# EAGLE design CityFireFly_3.0v (EAGLE 7.5.0)
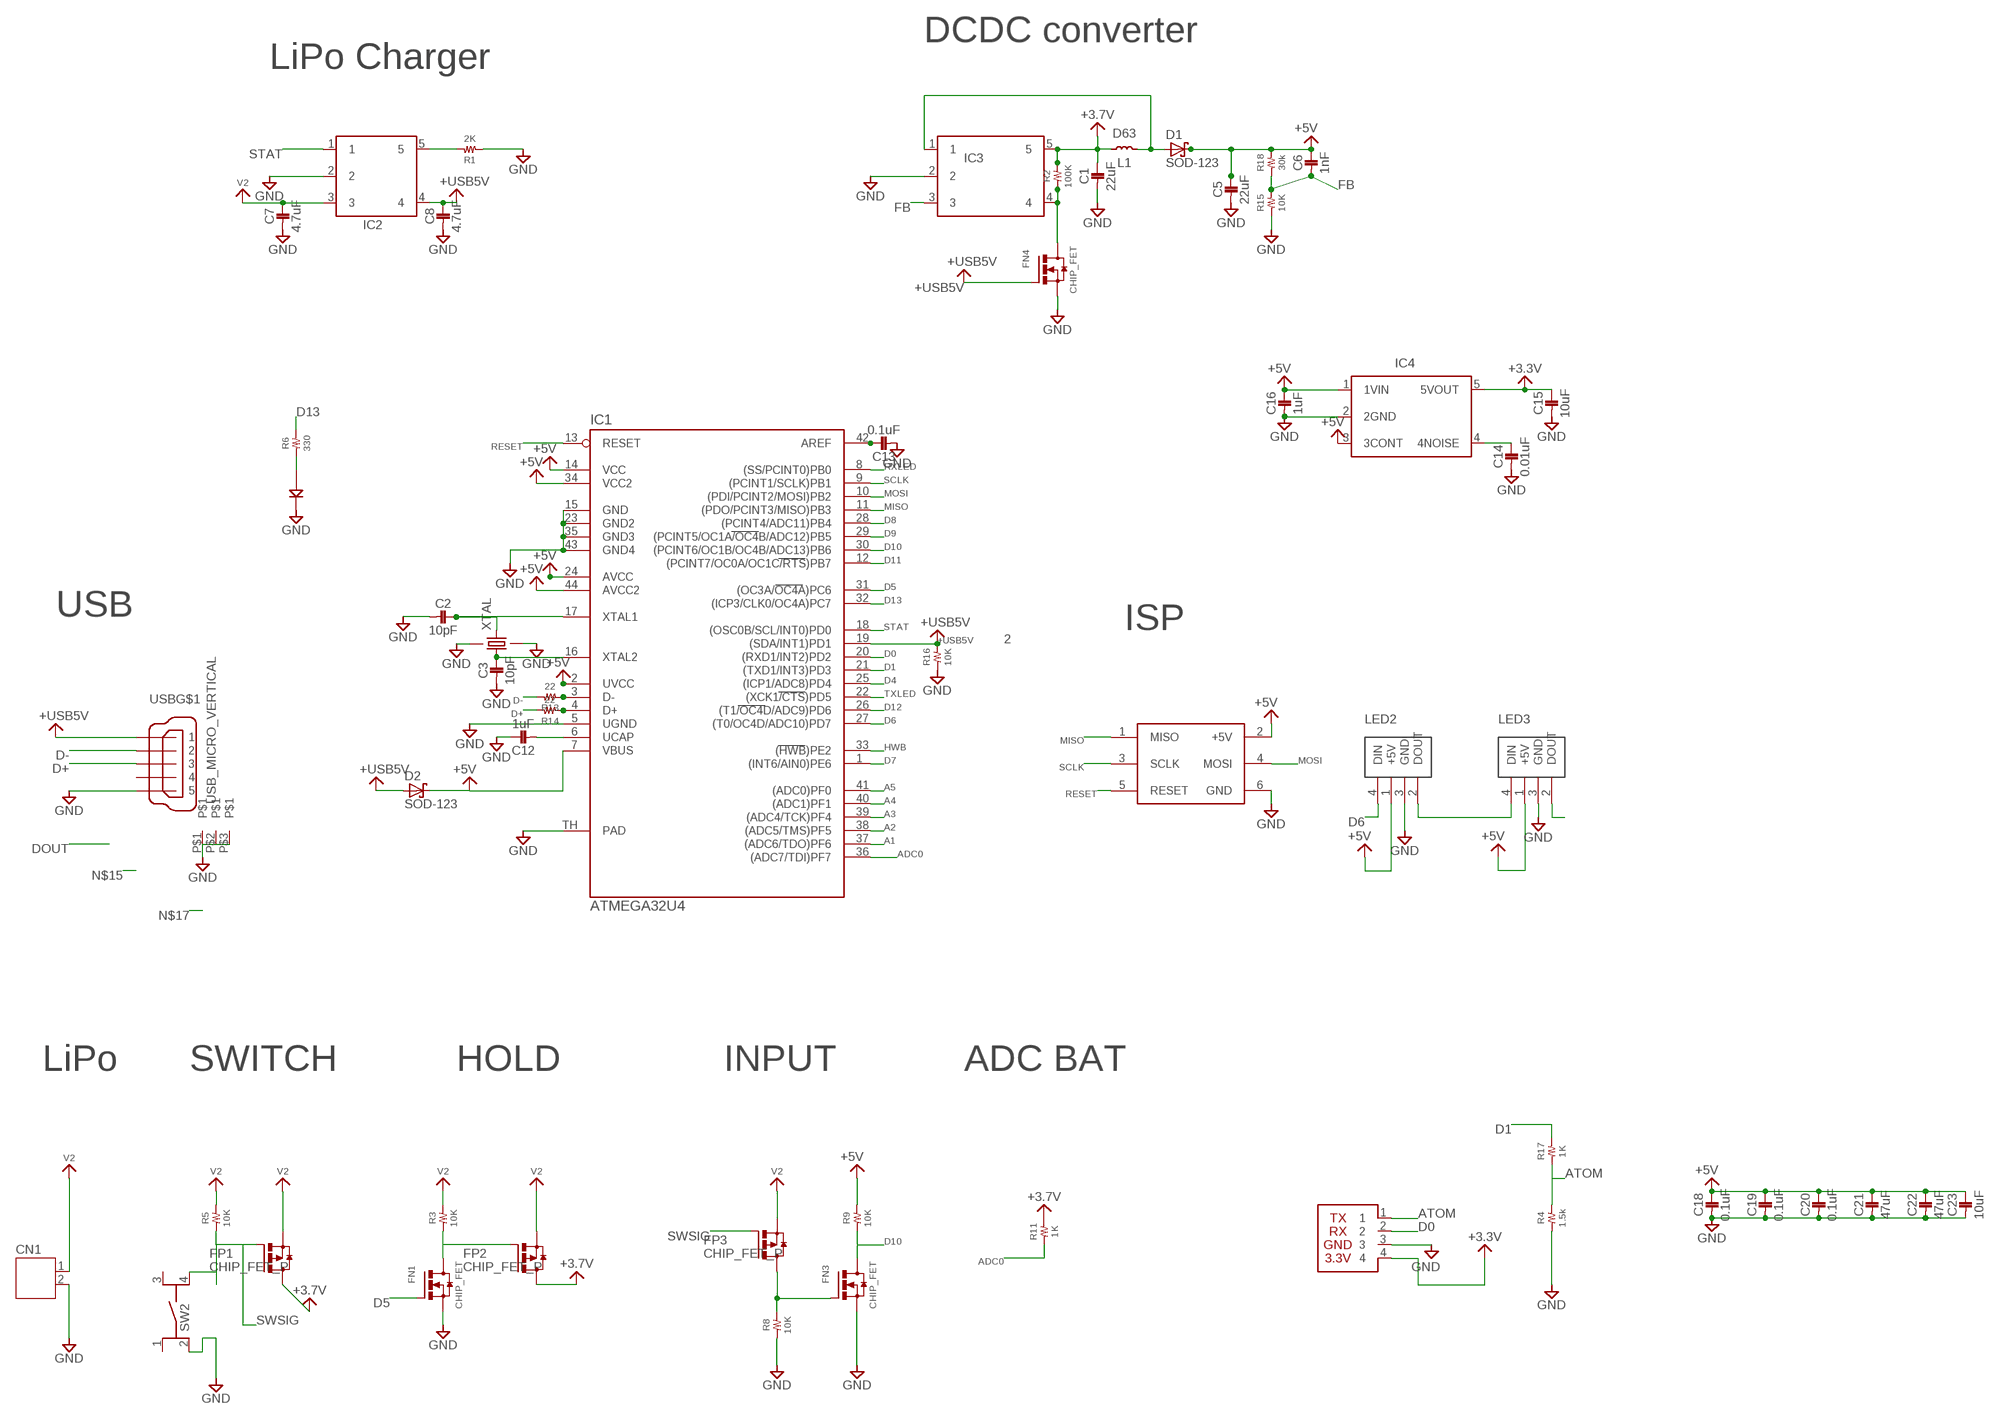
[diagram p0: schematic, sheet 1]

## Parts
BLE  BLE_SERIAL2_NO_HOLE  [BLESERIAL2_NO_HOLE]
C1  22uF  1608  [1608]
C2  10pF  1005  [1005]
C3  10pF  1005  [1005]
C5  22uF  1608  [1608]
C6  1nF  1005  [1005]
C7  4.7uF  1005  [1005]
C8  4.7uF  1005  [1005]
C12  1uF  1005  [1005]
C13  0.1uF  1005  [1005]
C14  0.01uF  1608  [1608]
C15  10uF  1608  [1608]
C16  1uF  1005  [1005]
C18  0.1uF  1005  [1005]
C19  0.1uF  1005  [1005]
C20  0.1uF  1005  [1005]
C21  47uF  1608  [1608]
C22  47uF  1608  [1608]
C23  10uF  1608  [1608]
CN1  JST-PH2  [JST-PH2]
D1  SOD-123  [SOD_123]
D2  SOD-123  [SOD_123]
FN1  CHIP_FET  [SOT23]
FN3  CHIP_FET  [SOT23]
FN4  CHIP_FET  [SOT23]
FP1  CHIP_FET_P  [SOT23]
FP2  CHIP_FET_P  [SOT23]
FP3  CHIP_FET_P  [SOT23]
IC1  ATMEGA32U4  [QFN-44-7X7]
IC2  MCP73831  [SOT23-5L]
IC3  LM2735  [SOT23-5L]
IC4  TAR5SB  [SSOP5-P-0.95]
L1  D63  [TOKO]
LED1  3MMLED  [3MM]
LED2  NEO_FLAT  [NEO_FLAT]
LED3  NEO_FLAT  [NEO_FLAT]
R1  2K  RESISTOR_1005  [1005]
R2  100K  RESISTOR_1005  [1005]
R3  10K  RESISTOR_1005  [1005]
R4  1.5k  RESISTOR_1005  [1005]
R5  10K  RESISTOR_1005  [1005]
R6  330  RESISTOR_1005  [1005]
R8  10K  RESISTOR_1005  [1005]
R9  10K  RESISTOR_1005  [1005]
R11  1K  RESISTOR_1005  [1005]
R13  22  RESISTOR_1005  [1005]
R14  22  RESISTOR_1005  [1005]
R15  10K  RESISTOR_1005  [1005]
R16  10K  RESISTOR_1005  [1005]
R17  1K  RESISTOR_1005  [1005]
R18  30k  RESISTOR_1005  [1005]
SW2  SKRPACE010  [SKRP]
U$3  ICSP  [ICSP]
USB  USB_MICRO_VERTICAL  [USB_MICRO_VERTICAL]
XTAL  FA-238  [FA-238]

## Nets
+3.3V: BLE.4 C15.P$1 IC4.5(5VOUT)
+3.7V: C1.P$1 FP1.3(D) FP2.3(D) IC3.5 L1.1 R2.2 R11.2
+5V: C5.P$1 C6.1 C16.1 C18.1 C19.1 C20.1 C21.P$1 C22.P$1 C23.P$1 D1.C D2.C IC1.2(UVCC) IC1.7(VBUS) IC1.14(VCC) IC1.24(AVCC) IC1.34(VCC2) IC1.44(AVCC2) IC4.1(1VIN) IC4.3(3CONT) LED2.1(+5V) LED3.1(+5V) R9.2 R18.2 U$3.2(+5V)
+USB5V: C8.1 D2.A FN4.1(G) IC1.19((SDA/INT1)PD1) IC2.4 R16.2 USB.1
A1: IC1.37((ADC6/TDO)PF6)
A2: IC1.38((ADC5/TMS)PF5)
A3: IC1.39((ADC4/TCK)PF4)
A4: IC1.40((ADC1)PF1)
A5: IC1.41((ADC0)PF0)
ADC0: IC1.36((ADC7/TDI)PF7) R11.1
ATOM: BLE.1 R4.2 R17.1
D0: BLE.2 IC1.20((RXD1/INT2)PD2)
D1: IC1.21((TXD1/INT3)PD3) R17.2
D4: IC1.25((ICP1/ADC8)PD4)
D5: FN1.1(G) IC1.31((OC3A/OC4A)PC6)
D6: IC1.27((T0/OC4D/ADC10)PD7) LED2.4(DIN)
D7: IC1.1((INT6/AIN0)PE6)
D8: IC1.28((PCINT4/ADC11)PB4)
D9: IC1.29((PCINT5/OC1A/OC4B/ADC12)PB5)
D10: FN3.3(D) IC1.30((PCINT6/OC1B/OC4B/ADC13)PB6) R9.1
D11: IC1.12((PCINT7/OC0A/OC1C/RTS)PB7)
D12: IC1.26((T1/OC4D/ADC9)PD6)
D13: IC1.32((ICP3/CLK0/OC4A)PC7) R6.2
D+: R14.2 USB.3
D-: R13.2 USB.2
DOUT: LED2.2(DOUT) LED3.4(DIN)
FB: C6.2 IC3.3 R15.2 R18.1
GND: BLE.3 C1.P$2 C2.2 C3.2 C5.P$2 C7.2 C8.2 C12.1 C13.2 C14.P$2 C15.P$2 C16.2 C18.2 C19.2 C20.2 C21.P$2 C22.P$2 C23.P$2 CN1.2 FN1.2(S) FN3.2(S) FN4.2(S) IC1.5(UGND) IC1.15(GND) IC1.23(GND2) IC1.35(GND3) IC1.43(GND4) IC1.TH(PAD) IC2.2 IC3.2 IC4.2(2GND) LED1.K LED2.3(GND) LED3.3(GND) R1.1 R4.1 R8.1 R15.1 R16.1 SW2.2(1_) U$3.6(GND) USB.5 USB.P$1 USB.P$2 USB.P$3 XTAL.2 XTAL.4
HWB: IC1.33((HWB)PE2)
MISO: IC1.11((PDO/PCINT3/MISO)PB3) U$3.1(MISO)
MOSI: IC1.10((PDI/PCINT2/MOSI)PB2) U$3.4(MOSI)
N$1: LED1.A R6.1
N$2: IC2.5 R1.2
N$3: FN4.3(D) IC3.4 R2.1
N$4: D1.A IC3.1 L1.2
N$6: FN1.3(D) FP2.1(G) R3.1
N$7: C3.1 IC1.16(XTAL2) XTAL.1
N$8: IC1.3(D-) R13.1
N$9: C13.1 IC1.42(AREF)
N$10: C2.1 IC1.17(XTAL1) XTAL.3
N$14: IC1.4(D+) R14.1
N$16: C14.P$1 IC4.4(4NOISE)
N$18: C12.2 IC1.6(UCAP)
OPTION: LED3.2(DOUT)
RESET: IC1.13(RESET) U$3.5(RESET)
RXLED: IC1.8((SS/PCINT0)PB0)
SCLK: IC1.9((PCINT1/SCLK)PB1) U$3.3(SCLK)
SIG: FN3.1(G) FP3.3(D) R8.2
STAT: IC1.18((OSC0B/SCL/INT0)PD0) IC2.1
SWSIG: FP1.1(G) FP3.1(G) R5.1 SW2.4(2_)
TXLED: IC1.22((XCK1/CTS)PD5)
V2 [POWER]: C7.1 CN1.1 FP1.2(S) FP2.2(S) FP3.2(S) IC2.3 R3.2 R5.2
Unconnected: SW2.1 SW2.3 USB.4

## Notes on the sheet
- DCDC converter
- LiPo Charger
- USB
- ISP
- 2
- LiPo | SWITCH | HOLD | INPUT | ADC BAT

## Library data of the parts
BLE = 12_module:BLE_SERIAL2_NO_HOLE
C1 C5 C14 C15 C21-C23 = 02_C:1608
C2 C3 C6-C8 C12 C13 C16 C18-C20 = 02_C:1005
CN1 = jst-ph (1):JST-PH2
D1 D2 = 15_DIODE:SOD-123
FN1 FN3 FN4 = 06_FET:CHIP_FET
FP1-FP3 = 06_FET:CHIP_FET_P
IC1 = 04_IC:ATMEGA32U4
IC2 = 04_IC:MCP73831
IC3 = 04_IC:LM2735
IC4 = 04_IC:TAR5SB
L1 = 03_L:D63
LED1 = 10_LED:3MMLED
LED2 LED3 = 10_LED:NEO_FLAT
R1-R6 R8 R9 R11 R13-R18 = 01_R:RESISTOR_1005
SW2 = 09_1_switch:SKRPACE010
U$3 = 08_CONECTOR:ICSP
USB = 08_CONECTOR:USB_MICRO_VERTICAL
XTAL = 09_2_CRYSTAL:FA-238

## Board
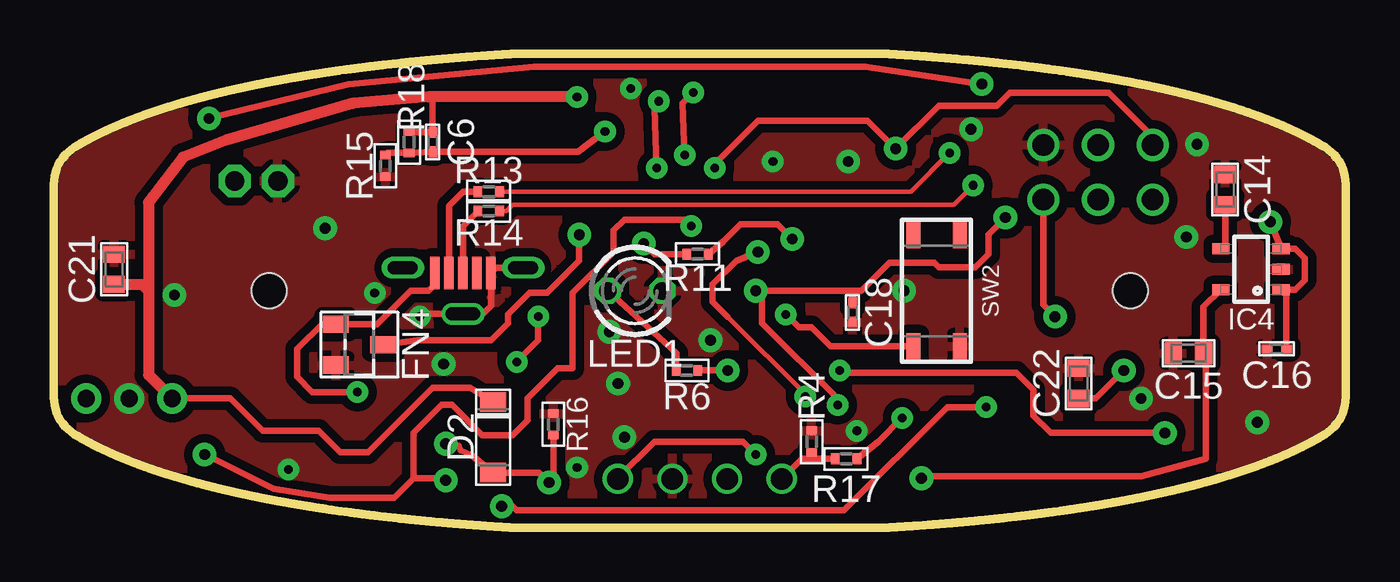
[diagram p1: board, top side]
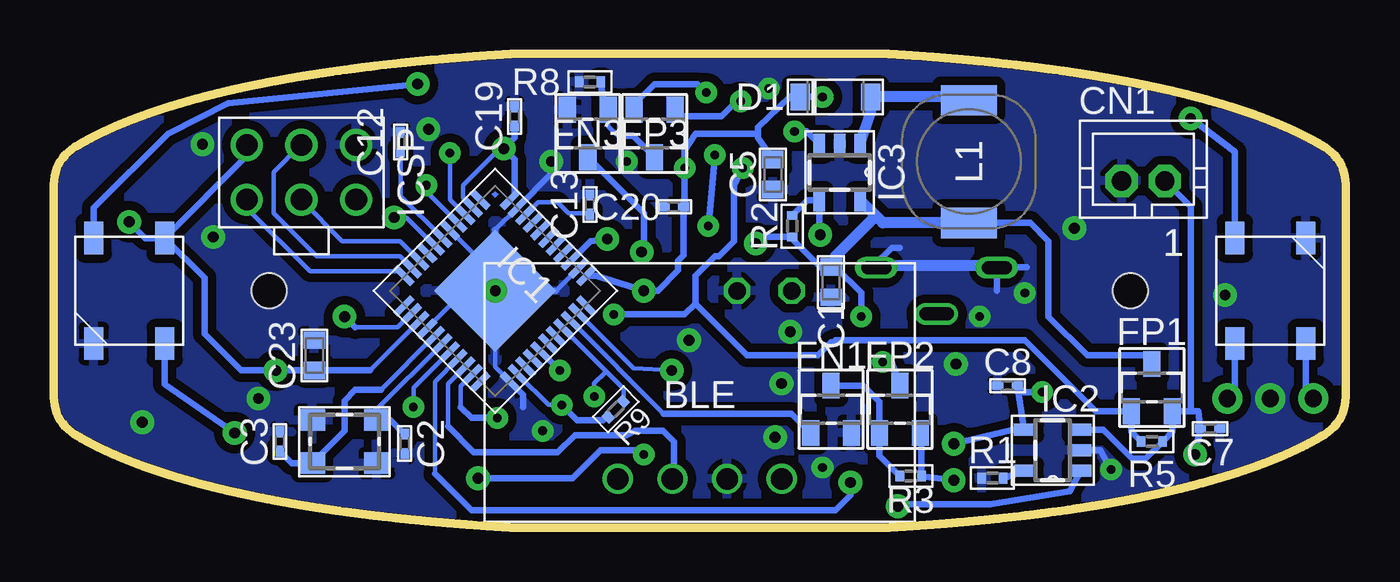
[diagram p2: board, bottom side, seen from below]

Size 60 x 22 mm. Coordinates in mm from the lower left corner, seen from the top.
Outline: 1964 segments
Copper layers (1*16): Top 0.035mm / dielectric 1.5mm / Bottom 0.035mm
Design rules "default *": minimum track width 0.2mm, minimum drill 0.4mm, track to track 0.4mm, track to pad 0.4mm, pad to pad 0.4mm, via to via 0.4mm, smd to smd 0.4mm, copper to edge 1mil, drill to drill 8mil, minimum pad ring 0.2mm, minimum via ring 0.3mm, stop-mask expansion 4mil, vias tented up to drill 0mil, thermal gap 10mil
Holes 1.6 mm at 10,11 50,11

### Footprints (pad centres in the part's own frame; a part is rotated, then mirrored left to right if it is on the bottom)
BLESERIAL2_NO_HOLE = drill 1: 1 -3.81,-2.73; 2 -1.27,-2.73; 3 1.27,-2.73; 4 3.81,-2.73
1608 = smd 0.8 x 1: P$1 -0.7,0; P$2 0.7,0
1005 = smd 0.5 x 0.4: 1 -0.45,0; 2 0.45,0
JST-PH2 = drill 0.9 pad 1.5 octagon: 1 1,0; 2 -1,0
SOD_123 = smd 0.915 x 1.22: A -1.64,0; C 1.64,0
SOT23 = smd 0.8 x 1.2: 1 -0.95,-1.1; 2 0.95,-1.1; 3 0,1.1
QFN-44-7X7 = smd 1.1 x 0.3: 1 -3.5,2.5; 2 -3.5,2; 3 -3.5,1.5; 4 -3.5,1; 5 -3.5,0.5; 6 -3.5,0; 7 -3.5,-0.5; 8 -3.5,-1; 9 -3.5,-1.5; 10 -3.5,-2; 11 -3.5,-2.5; 23 3.5,-2.5; 24 3.5,-2; 25 3.5,-1.5; 26 3.5,-1; 27 3.5,-0.5; 28 3.5,0; 29 3.5,0.5; 30 3.5,1; 31 3.5,1.5; 32 3.5,2; 33 3.5,2.5 | smd 0.3 x 1.1: 12 -2.5,-3.5; 13 -2,-3.5; 14 -1.5,-3.5; 15 -1,-3.5; 16 -0.5,-3.5; 17 0,-3.5; 18 0.5,-3.5; 19 1,-3.5; 20 1.5,-3.5; 21 2,-3.5; 22 2.5,-3.5; 34 2.5,3.5; 35 2,3.5; 36 1.5,3.5; 37 1,3.5; 38 0.5,3.5; 39 0,3.5; 40 -0.5,3.5; 41 -1,3.5; 42 -1.5,3.5; 43 -2,3.5; 44 -2.5,3.5 | smd 4 x 4: TH 0,0
SOT23-5L = smd 0.55 x 1: 1 -0.95,-1.3; 2 0,-1.3; 3 0.95,-1.3; 4 0.95,1.3; 5 -0.95,1.3
SSOP5-P-0.95 = smd 0.5 x 0.8: 1 -0.95,-1.4; 2 0,-1.4; 3 0.95,-1.4; 4 0.95,1.4; 5 -0.95,1.4
TOKO = smd 1.4 x 2.6: 1 -2.85,0; 2 2.85,0
3MM = drill 0.813 octagon: A 0,1.27; K 0,-1.27
NEO_FLAT = smd 1.5 x 0.9: 1 -2.45,1.65; 2 -2.45,-1.65; 3 2.45,-1.65; 4 2.45,1.65
1005' = smd 0.4 x 0.5: 1 -0.5,0; 2 0.5,0
SKRP = smd 1.2 x 0.65: 1 -2.575,1.075; 2 2.575,1.075; 3 -2.575,-1.075; 4 2.575,-1.075
ICSP = drill 1 pad 1.5: 1 -1.27,2.54; 2 1.27,2.54; 3 -1.27,0; 4 1.27,0; 5 -1.27,-2.54; 6 1.27,-2.54
USB_MICRO_VERTICAL = smd 0.45 x 1.5: 1 -1.3,0.825; 2 -0.65,0.825; 3 0,0.825; 4 0.65,0.825; 5 1.3,0.825 | drill 0.6 long: P$1 0,-1.075; P$2 -2.8,1.075; P$3 2.8,1.075 | drill 0.5: P$4 -2.8,1.075; P$11 2.8,1.075 | drill 0.6: P$5 -2.9,1.075; P$6 -3,1.075; P$7 -3.2,1.075; P$8 -2.7,1.075; P$9 -2.6,1.075; P$10 -2.4,1.075; P$12 2.7,1.075; P$13 2.6,1.075; P$14 2.4,1.075; P$15 2.9,1.075; P$16 3,1.075; P$17 3.2,1.075; P$18 0,-1.075; P$19 -0.1,-1.075; P$20 -0.2,-1.075; P$21 -0.3,-1.075; P$22 -0.4,-1.075; P$23 -0.5,-1.075; P$24 0.1,-1.075; P$25 0.2,-1.075; P$26 0.3,-1.075; P$27 0.4,-1.075; P$28 0.5,-1.075; P$29 3.1,1.075; P$30 -3.1,1.075; P$31 2.5,1.075; P$32 -2.5,1.075
FA-238 = smd 1.2 x 1: 1 -1.5,-1; 2 1.5,-1; 3 1.5,1; 4 -1.5,1

### Placement (x,y rotation side)
BLE  30,5 0 bottom
C1  23.9,11.4 270 bottom
C2  43.7,3.9 270 bottom
C3  49.5,4 90 bottom
C5  26.6,16.4 270 bottom
C6  17.6,17.9 270 top
C7  6.3,4.6 0 bottom
C8  15.7,6.6 180 bottom
C12  43.9,17.9 270 bottom
C13  35.1,15 90 bottom
C14  54.4,15.7 90 top
C15  52.7,8.1 180 top
C16  56.8,8.3 180 top
C18  37.1,10 270 top
C19  38.6,19.1 90 bottom
C20  31.2,14.9 180 bottom
C21  2.8,12 90 top
C22  47.6,6.7 90 top
C23  47.9,8 90 bottom
CN1  9.4,16.1 0 bottom
D1  23.7,20 180 bottom
D2  20.4,4.2 90 top
FN1  23.9,5.5 0 bottom
FN3  35.2,18.3 180 bottom
FN4  14.2,8.5 270 top
FP1  9,6.5 0 bottom
FP2  20.7,5.5 0 bottom
FP3  32.1,18.3 180 bottom
IC1  39.5,11 315 bottom
IC2  13.6,3.6 90 bottom
IC3  23.5,16.5 180 bottom
IC4  55.6,12 90 top
L1  17.5,17 90 bottom
LED1  27,11 90 top
LED2  56.5,11 270 bottom
LED3  3.5,11 90 bottom
R1  2K  [1005']  16.4,2.3 0 bottom
R2  100K  [1005']  25.7,14 270 bottom
R3  10K  [1005']  20.2,2.4 0 bottom
R4  1.5k  [1005']  35.2,4 270 top
R5  10K  [1005']  9,4 0 bottom
R6  330  [1005']  29.4,7.3 0 top
R8  10K  [1005']  35.1,20.7 0 bottom
R9  10K  [1005']  33.9,5.5 225 bottom
R11  1K  [1005']  29.9,12.7 180 top
R13  22  [1005']  20.2,15.6 180 top
R14  22  [1005']  20.2,14.7 180 top
R15  10K  [1005']  15.4,16.8 90 top
R16  10K  [1005']  23.2,4.8 270 top
R17  1K  [1005']  36.8,3.2 0 top
R18  30k  [1005']  16.5,17.9 90 top
SW2  41,11 270 top
U$3  48.5,16.5 90 bottom
USB  19,11 0 top
XTAL  46.5,4 0 bottom

### Tracks (layer width: path | path; a pad name or v marks a point on that pad's centre or on a via)
+3.3V  (via drill 0.4, 0.5)
  Top 0.3: BLE.4 26.19,2.29 27.9,4 32,4 v32.6,3.4 | IC4.5 53.4,10.25 C15.P$1 53.5,8 53.5,3.2 50.5,2.4 40.4,2.4 v40.3,2.3
  Bottom 0.3: v32.6,3.4 32.8,3.4 33,3.6 34.6,3.6 35.9,2.3 v40.3,2.3
+3.7V  (via drill 0.4, 0.5)
  Top 0.3: 27.6,13 v27.4,13.2 27.9,12.7 R11.2 | v21.5,7.7 22.5,8.7 v22.5,9.8
  Bottom 0.3: FP1.3 9.4,8 12,8 13.8,9.8 13.8,13.3 14.65,14.15 L1.1 | v27.4,13.2 27.1,13.5 R2.2 25.7,13.4 24.4,12.1 C1.P$1 23.7,12.1 22.5,10.9 v22.5,9.8 | FP2.3 21.1,7.7 v21.5,7.7
  Bottom 0.5: L1.1 21.5,14.15 21.83,14.48 | 21.83,14.48 IC3.5 | 23.7,12.1 23.7,12.6 21.83,14.48
+5V  (via drill 0.4, 0.5, 0.8)
  Top 0.3: v49.7,7.3 48.4,6 C22.P$1 | 33.55,11 v32.6,11 | R18.2 16.55,18.35 C6.1 17.6,20 | 37.2,11 37.5,11 38.8,12.3 40.9,12.3 41.1,12.1 42.8,12.1 43.4,12.7 43.4,13.6 v44.2,14.4 | 37.2,11 v32.6,11 | C18.1 37.1,10.9 37.2,11 | v30.7,16.7 30.7,16.9 32.7,18.9 37.8,18.9 v39.1,17.6 41.1,19.6 43.8,19.6 44.4,20.2 49,20.2 51.04,18.16 U$3.2 | D2.C 19.34,6.5 17.6,6.5 14.6,3.5 13.3,3.5 12.3,4.5 9.7,4.5 8.2,6 v5.5,6 | v56.5,14.2 IC4.3 57.65,12.95 58.1,12.5 58.1,11.5 57.65,11.05 IC4.1 57.25,10.8 C16.1 | v36.4,5.7 36.4,6 32.9,9.5 32.9,10.7 v32.6,11
  Top 0.5: v24.3,20 17.6,20 17.4,20 13.9,19.7 8,18 6,17.2 4.4,15.1 4.4,11 | 4.4,11 4.4,7.1 v5.5,6 | C21.P$1 4.1,11.3 4.4,11
  Bottom 0.2: IC1.7 43.61,14.4 v44.2,14.4 | IC1.2 41,15.33 41,15.9 39.3,17.6 v39.1,17.6 | IC1.14 45.32,7.3 | IC1.24 37.03,5.7 v36.4,5.7
  Bottom 0.3: 45.32,7.3 C23.P$1 v49.7,7.3 51.3,7.3 53,9 53,11.6 LED2.1 | IC1.34 34.81,11.71 v32.6,11 31.95,11 31,11.95 31,12.4 30.75,12.65 C20.1 30.7,14.95 v30.7,16.7 | v5.5,6 5.15,6.35 LED3.1 | v36.4,5.7 35.7,5 34.5,5 R9.2 | IC1.44 38.6,15.44 38.6,17.1 v39.1,17.6 38.6,18.1 C19.1 | v24.3,20 D1.C 25.8,20 27.3,18.6 27.3,18.3 | v56.5,14.2 55.75,13.45 LED2.1 | LED2.1 51.04,17.26 U$3.2 | v30.7,16.7 30.65,16.75 | 27.3,18.3 30.2,18.3 30.7,17.5 v30.7,16.7 | C5.P$1 27.3,18.1 27.3,18.3
+USB5V  (via drill 0.4, 0.5)
  Top 0.3: R16.2 23.2,2.3 v23,2.1 22.54,2.56 D2.A 19.4,3.36 18.9,3.6 18.8,3.8 v18.2,3.9 | v14.1,6.3 12,6.3 11.3,7 11.3,8.3 12.45,9.45 FN4.1 15.03,9.45 16.58,11 17.4,11 17.7,11.3 USB.1
  Bottom 0.2: IC1.19 42.3,6.79 42.3,2.5
  Bottom 0.3: v23,2.1 23,1.5 23.7,0.8 40.6,0.8 42.3,2.5 | v18.2,3.9 15.45,4.55 IC2.4 14.95,4.6 C8.1 14.95,6.3 v14.1,6.3
ADC0  (via drill 0.5)
  Top 0.3: R11.1 31.1,13.3 31.9,14.1 33.6,14.1 v34.3,13.4
  Bottom 0.3: v34.3,13.4 35.08,13.3 IC1.36
ATOM
  Top 0.3: BLE.1 34.74,3.2 35.1,3.2 | 35.1,3.2 R17.1 | R4.2 35.1,3.4 35.1,3.2
D0
  Bottom 0.2: IC1.20 41.7,6.68 41.7,4.7
  Bottom 0.3: 41.7,4.7 40.5,3.5 36.6,3.5 35.8,4.3 33.4,4.3 33,4.5 31.7,4.5 31.2,4 31.2,2.34 BLE.2
D1  (via drill 0.4)
  Top 0.3: v39.4,5.1 38.3,4 R17.2
  Bottom 0.2: IC1.21 41.1,6.57 41.1,5.6
  Bottom 0.3: 41.1,5.6 40.6,5.1 v39.4,5.1
D5
  Bottom 0.2: IC1.31 31.68,5.3
  Bottom 0.3: FN1.1 25.75,5.3 31.3,5.3 31.68,5.3
D6  (via drill 0.4, 0.5)
  Top 0.3: v36.5,7.3 37,7.2 44.7,7.2 45.5,6.4 45.5,5.2 46.3,4.4 v51.6,4.4
  Bottom 0.3: IC1.27 36.71,7.5 v36.5,7.3 | v51.6,4.4 54.85,6.65 LED2.4
D10  (via drill 0.4, 0.5)
  Top 0.2: 31.3,9.8 34.9,6.2 v34.9,6.1
  Top 0.3: 31.3,9.8 30.6,10.5 30.6,11.3 31.7,12.4 v32.7,12.8
  Bottom 0.2: IC1.30 34.29,7.2 | R9.1 33.55,6.46 34.29,7.2 | 34.29,7.2 34.4,7.2 34.9,6.7 v34.9,6.1
  Bottom 0.3: v32.7,12.8 32.6,13 32.6,14.6 FN3.3
D13  (via drill 0.5)
  Top 0.3: v31.3,7.3 R6.2
  Bottom 0.2: IC1.32 33.07,7.4 v31.3,7.3
D+
  Top 0.3: USB.3 19,14 R14.2
D-
  Top 0.3: USB.2 18.35,14.95 19,15.6 R13.2
DOUT  (via drill 0.5)
  Top 0.3: v43.1,20.6 37.7,21.4 22.3,21.4 13.7,20.6 v7.2,19
  Bottom 0.3: v43.1,20.6 51.9,19.7 54.7,18.3 58.15,14.85 LED2.2 | v7.2,19 5.15,17.45 LED3.4
FB  (via drill 0.4)
  Top 0.3: v25.6,18.4 24.35,17.45 C6.2 16.75,17.4 R18.1 15.5,17.4 R15.2
  Bottom 0.3: IC3.3 25.05,18.4 v25.6,18.4
GND  (via drill 0.4, 0.5, 0.8)
  Top 0.3: 17.33,9.93 17.3,9.9 | USB.P$3 20.55,12.08 USB.5 20.3,10.3 19.93,9.93 USB.P$1 17.23,9.93 v17,9.8 | v36.9,17 36.7,17
  Bottom 0.2: IC1.23 39.5,7.46 IC1.TH | IC1.35 36.67,11 | IC1.43 39.5,13.83 | IC1.5 39.5,11.71 | IC1.15 40.91,11
  Bottom 0.3: 39.5,11.71 IC1.TH | 40.91,11 IC1.TH | USB.P$3 21.83,12.1 | 36.67,11 IC1.TH | 16.2,11 USB.P$2 16.18,12.1 14.8,12.1 | IC1.43 36.9,16.43 v36.9,17 | 39.5,13.83 IC1.TH | IC2.2 11.4,3.6 v10.9,2.7 | IC1.23 38.2,6.16 38.2,5.6 | 21.83,12.1 21.9,12.18 21.08,13 20.7,13 | 21.83,12.1 20.4,12.1
  Bottom 0.5: 21.9,12.18 16.3,12.18 USB.P$2
  other vias: 39.5,11 3.5,6 52.6,13.5 42.6,18.5 55.9,4.9 33.4,17 26.2,6.7 18.1,7.6 26.5,4.2 12.6,13.9 25.8,9.1 37.3,4.5 14.9,10.9 5.6,10.8 50.5,6 30.5,8.7 53.1,17.8 24.3,2.8 26.8,20.4
  pour Bottom: -25,-3 -25,25 85,25 85,-3
  pour Top: -25,-3 -25,25 85,25 85,-3
MISO
  Bottom 0.2: 43.94,11.9 48.1,11.9 51.04,14.84 U$3.1
  Bottom 0.3: IC1.11 43.94,11.9
MOSI
  Bottom 0.2: IC1.10 43.93,12.6 47.8,12.6 49.8,14.6 49.8,16.5 48.53,17.77 U$3.4
N$1
  Top 0.3: R6.1 28.93,8.1 LED1.A
N$2
  Bottom 0.3: R1.2 IC2.5
N$3  (via drill 0.5)
  Top 0.3: v24.4,13.6 24.4,12.4 22.9,10.9 22.1,10.9 21.1,9.9 21.1,9.5 20.3,8.7 16.9,8.7 FN4.3
  Bottom 0.3: R2.1 25,15.2 IC3.4 24.45,13.65 v24.4,13.6
N$4
  Bottom 0.3: L1.2 17.65,20
  Bottom 0.5: 17.65,20 D1.A 22.05,19.31 IC3.1
N$6
  Bottom 0.3: FN1.3 22.4,6.6 21.65,5.85 FP2.1 21.65,3.35 R3.1
N$7
  Bottom 0.2: IC1.16 44.81,6.4
  Bottom 0.3: 44.81,6.4 46,6.4 46.5,5.9 46.5,4.5 XTAL.1 48.95,3 C3.1
N$8  (via drill 0.4)
  Top 0.2: v41.6,17.4 39.8,15.6 R13.1
  Bottom 0.2: IC1.3 41.6,15.22 v41.6,17.4
N$9
  Bottom 0.2: IC1.42 37.52,15.1 36.6,15.1 36.1,14.6 35.15,14.6 C13.1
N$10
  Bottom 0.2: IC1.17 45,5.5
  Bottom 0.3: 45,5.5 XTAL.3 44.35,5 C2.1
N$14  (via drill 0.4)
  Top 0.2: R14.1 21,14.7 21.3,15 41.8,15 v42.7,15.9
  Bottom 0.2: IC1.4 42.7,15.61 v42.7,15.9
  Bottom 0.3: v42.7,15.9 42.69,15.6
N$16
  Top 0.3: IC4.4 54.4,13.15 C14.P$1
N$18
  Bottom 0.2: IC1.6 43.9,15.4 C12.2
OPTION  (via drill 0.8)
  Bottom 0.3: v1.5,6 1.85,6.35 LED3.2
RESET  (via drill 0.5)
  Top 0.3: v46.5,9.8 45.96,10.36 U$3.5
  Bottom 0.2: IC1.13 44.03,9.3 46,9.3
  Bottom 0.3: 46,9.3 v46.5,9.8
SCLK
  Bottom 0.2: IC1.9 43.92,13.3 46.6,13.3 48.5,15.2 U$3.3
SIG
  Bottom 0.2: 33.5,18.2 33.8,18.2 34.25,18.65 FN3.1
  Bottom 0.3: R8.2 34.5,19.95 FN3.1 34.25,18.95 | FP3.3 33.1,18.2 33.5,18.2
STAT  (via drill 0.4, 0.5)
  Top 0.3: v20.8,1 21.3,1 21.5,0.8 36.7,0.8 41.5,5.6 v43.3,5.6
  Bottom 0.2: IC1.18 43.3,6.49 v43.3,5.6
  Bottom 0.3: v20.8,1 20.7,1.1 16.5,1.1 12.8,1.7 IC2.1
SWSIG  (via drill 0.4)
  Top 0.3: v28,16.7 27.9,19.5 v28.1,19.8 | SW2.4 36.08,8.43 35.2,9.3 34.6,9.3 v34,9.9
  Bottom 0.3: R5.1 9.95,4.45 FP1.1 11.6,5.4 14.9,8.7 23.7,8.7 23.8,8.6 23.9,8.6 24.5,8 27.8,8 30.2,10.4 | 30.2,10.4 30.2,11.7 29.3,12.6 29.1,12.6 28.4,13.3 28.4,15.9 v28,16.7 | v34,9.9 30.7,9.9 30.2,10.4 | FP3.1 30.85,19.1 29,19.1 28.3,19.8 v28.1,19.8
V2  (via drill 0.4, 0.5)
  Top 0.3: v18.2,2.2 18.1,2.3 16.7,2.3 | 16.7,2.3 16.7,4.4 18,5.7 18.5,5.7 19.9,4.3 21.3,4.3 22,5 22,6 23.4,7.4 24.1,7.4 24.1,10.9 26,12.8 26,13.8 26.5,14.3 29.3,14.3 v29.6,14 | v7,3.4 10.2,1.8 12.8,1.4 15.8,1.4 16.7,2.3 | v29.3,17.3 29.2,19.7 v29.7,20.2
  Bottom 0.3: 7.2,5.4 6.85,5.4 C7.1 v7,3.4 | 7.2,5.4 FP1.2 8.05,4.45 R5.2 9.3,3.2 9.9,3.2 11.25,4.55 IC2.3 | 7.2,5.4 7.2,14.9 CN1.1 | v29.3,17.3 v29.6,14 | v18.2,2.2 R3.2 19.7,4.35 FP2.2 | FP3.2 33.05,19.65 32.1,20.6 30.1,20.6 v29.7,20.2